# Altium schematic sheet Glog 5G_LTE.SchDoc: RCW-360Pro-4G
size A3; Author: GAOQIANBO; DocumentNumber: JC-2.757.366DL; SheetNumber: 2; SheetTotal: 2
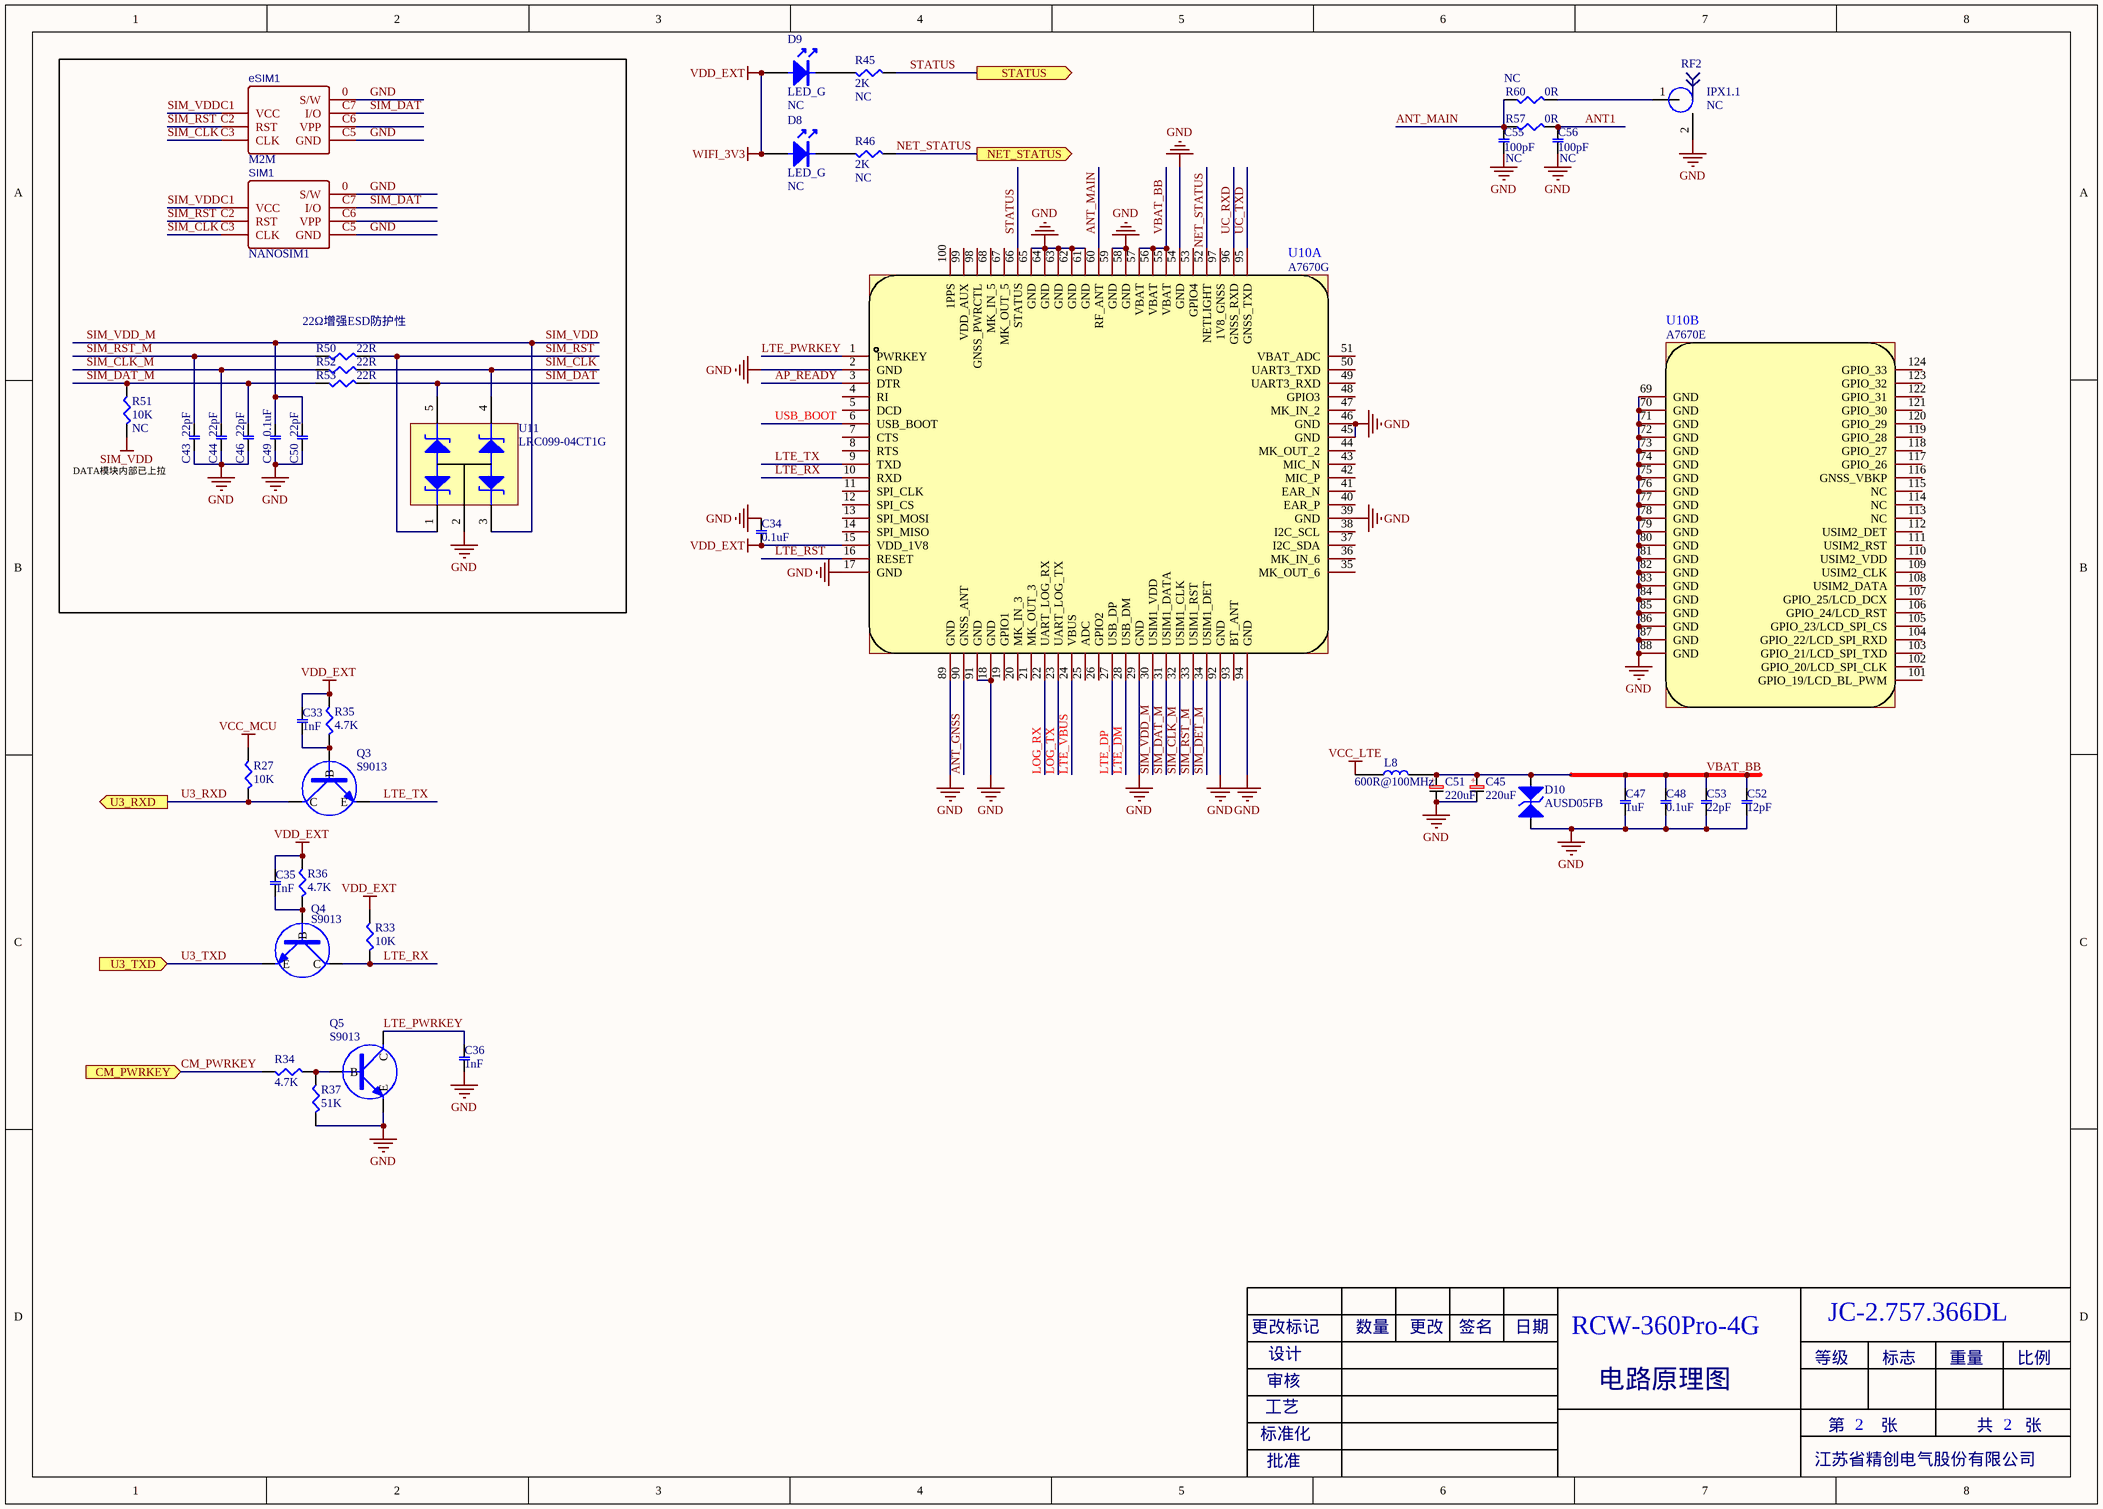
[diagram p0: Glog 5G_LTE.SchDoc]

## Parts
C33  1nF  [0402C]
C34  0.1uF  [0402C]
C35  1nF  [0402C]
C36  1nF  [0402C]
C43  22pF  [0402C]
C44  22pF  [0402C]
C45  220uF  [3528C]
C46  22pF  [0402C]
C47  1uF  [0402C]
C48  0.1uF  [0402C]
C49  0.1uF  [0402C]
C50  22pF  [0402C]
C51  220uF  [3528C]
C52  12pF  [0402C]
C53  22pF  [0402C]
C55  选焊: NC  [0402C]  (hidden comment: 100pF)
C56  选焊: NC  [0402C]  (hidden comment: 100pF)
D8  选焊: NC  [LED-0603]  (hidden comment: LED_G)
D9  选焊: NC  [LED-0603]  (hidden comment: LED_G)
D10  AUSD05FB  [BV05C]
eSIM1  M2M  [QFN5*6-8]
L8  600R@100MHz  [0603L]
Q3  S9013  [SOT23-N]
Q4  S9013  [SOT23-N]
Q5  S9013  [SOT23-N]
R27  10K  [0402R]
R33  10K  [0402R]
R34  4.7K  [0402R]
R35  4.7K  [0402R]
R36  4.7K  [0402R]
R37  51K  [0402R]
R45  选焊: NC  [0402R]  (hidden comment: 2K)
R46  选焊: NC  [0402R]  (hidden comment: 2K)
R50  22R  [0402R]
R51  选焊: NC  [0402R]  (hidden comment: 10K)
R52  22R  [0402R]
R53  22R  [0402R]
R57  0R  [0402R]
R60  选焊: NC  [0402R]  (hidden comment: 0R)
RF2  选焊: NC  [IPEX_3PIN]  (hidden comment: IPX1.1)
SIM1  NANOSIM1  [NANO_SIM SMT 翻盖式]
U10  A7670G  [A7670xx]  (parts A,B of 2)
U11  LRC099-04CT1G  [SOT-353]

## Blocks framed on the sheet
22Ω增强ESD防护性: C43 C44 C46 C49 C50 eSIM1 R50-R53 SIM1 U11

## Ports
CM_PWRKEY (in), NET_STATUS (out), STATUS (out), U3_RXD (out), U3_TXD (in)

## Nets
GND: C34.2 C36.1 C43.1 C44.1 C45.2 C46.1 C47.2 C48.2 C49.2 C50.1 C51.2 C52.1 C53.1 C55.2 C56.2 D10.2(K) eSIM1.0(S/W) eSIM1.C5(GND) Q5.E R37.2 RF2.2 SIM1.0(S/W) SIM1.C5(GND) U10.2(GND) U10.17(GND) U10.18(GND) U10.29(GND) U10.39(GND) U10.45(GND) U10.46(GND) U10.54(GND) U10.58(GND) U10.59(GND) U10.61(GND) U10.62(GND) U10.63(GND) U10.64(GND) U10.65(GND) U10.69(GND) U10.70(GND) U10.71(GND) U10.72(GND) U10.73(GND) U10.74(GND) U10.75(GND) U10.76(GND) U10.77(GND) U10.78(GND) U10.79(GND) U10.80(GND) U10.81(GND) U10.82(GND) U10.83(GND) U10.84(GND) U10.85(GND) U10.86(GND) U10.87(GND) U10.88(GND) U10.89(GND) U10.91(GND) U10.92(GND) U10.94(GND) U11.2
SIM_VDD: C49.1 C50.2 eSIM1.C1(VCC) R51.1 SIM1.C1(VCC) U10.30(USIM1_VDD) U11.3  [also labelled SIM_VDD_M]
VCC_LTE: L8.1
VCC_MCU: R27.1
VDD_EXT: C33.2 C34.1 C35.2 D8.1(A) D9.1(A) R33.1 R35.2 R36.2 U10.15(VDD_1V8)  [also labelled WIFI_3V3]
ANT1: C56.1 R57.2
ANT_GNSS: U10.90(GNSS_ANT)
ANT_MAIN: C55.1 R57.1 R60.1 U10.60(RF_ANT)
AP_READY: U10.3(DTR)
CM_PWRKEY: R34.2 ; port CM_PWRKEY
LOG_RX: U10.22(UART_LOG_RX)
LOG_TX: U10.23(UART_LOG_TX)
LTE_DM: U10.28(USB_DM)
LTE_DP: U10.27(USB_DP)
LTE_PWRKEY: C36.2 Q5.C U10.1(PWRKEY)
LTE_RST: U10.16(RESET)
LTE_RX: Q4.C R33.2 U10.10(RXD)
LTE_TX: Q3.E U10.9(TXD)
LTE_VBUS: U10.24(VBUS)
NET_STATUS: R46.1 U10.52(NETLIGHT) ; port NET_STATUS
SIM_CLK: eSIM1.C3(CLK) R52.2 SIM1.C3(CLK) U11.4
SIM_CLK_M: C44.2 R52.1 U10.32(USIM1_CLK)
SIM_DAT: eSIM1.C7(I/O) R53.2 SIM1.C7(I/O) U11.5
SIM_DAT_M: C46.2 R51.2 R53.1 U10.31(USIM1_DATA)
SIM_DET_M: U10.34(USIM1_DET)
SIM_RST: eSIM1.C2(RST) R50.2 SIM1.C2(RST) U11.1
SIM_RST_M: C43.2 R50.1 U10.33(USIM1_RST)
STATUS: R45.1 U10.66(STATUS) ; port STATUS
U3_RXD: Q3.C R27.2 ; port U3_RXD
U3_TXD: Q4.E ; port U3_TXD
UC_RXD: U10.96(GNSS_RXD)
UC_TXD: U10.95(GNSS_TXD)
USB_BOOT: U10.6(USB_BOOT)
VBAT_BB: C45.1 C47.1 C48.1 C51.1 C52.2 C53.2 D10.1(A) L8.2 U10.55(VBAT) U10.56(VBAT) U10.57(VBAT)
NetC33_1: C33.1 Q3.B R35.1
NetC35_1: C35.1 Q4.B R36.1
NetD8_2: D8.2(K) R46.2
NetD9_2: D9.2(K) R45.2
NetQ5_B: Q5.B R34.1 R37.1
NetR60_2: R60.2 RF2.1

Not connected (* = marked no-connect by the designer): eSIM1 C6(VPP); SIM1 C6(VPP); U10 4(RI) 5(DCD) 7(CTS) 8(RTS) 11(SPI_CLK) 12(SPI_CS) 13(SPI_MOSI) 14(SPI_MISO) 19(GPIO1) 20(MK_IN_3) 21(MK_OUT_3) 25(ADC) 26(GPIO2) 35(MK_OUT_6) 36(MK_IN_6) 37(I2C_SDA) 38(I2C_SCL) 40(EAR_P) 41(EAR_N) 42(MIC_P) 43(MIC_N) 44(MK_OUT_2) 47(MK_IN_2) 48(GPIO3) 49(UART3_RXD) 50(UART3_TXD) 51(VBAT_ADC) 53(GPIO4) 67(MK_OUT_5) 68(MK_IN_5) 93(BT_ANT) 97(1V8_GNSS) 98(GNSS_PWRCTL) 99(VDD_AUX) 100(1PPS) 101(GPIO_19/LCD_BL_PWM) 102(GPIO_20/LCD_SPI_CLK) 103(GPIO_21/LCD_SPI_TXD) 104(GPIO_22/LCD_SPI_RXD) 105(GPIO_23/LCD_SPI_CS) 106(GPIO_24/LCD_RST) 107(GPIO_25/LCD_DCX) 108(USIM2_DATA) 109(USIM2_CLK) 110(USIM2_VDD) 111(USIM2_RST) 112(USIM2_DET) 113(NC) 114(NC) 115(NC) 116(GNSS_VBKP) 117(GPIO_26) 118(GPIO_27) 119(GPIO_28) 120(GPIO_29) 121(GPIO_30) 122(GPIO_31) 123(GPIO_32) 124(GPIO_33)

## Notes on the sheet
- (near R51) DATA模块内部已上拉
- 更改标记
- 审核
- 设计
- 数量
- 更改
- 签名
- 日期
- 电路原理图
- 等级
- 标志
- 重量
- 比例
- 标准化
- 工艺
- 第        张
- 共       张
- 批准
- 江苏省精创电气股份有限公司
- (in symbol 220μF/6.3V/CASE-B_3528±20﹪) +

## Library data of the parts
C33 C35 C36 = CC-0402-X7R-50V-102±10%,风华高科,RoHS: 物料编码(*): 30102010010; 物料名称: 贴片瓷片电容; 参考价格: 0.038; 用量分母: 1; 贴片/插件: SMD; Values: 1nF; 规格型号: CC-0402-X7R-50V-102±10%,风华高科,RoHS
C34 C48 C49 = CC-0402-50V-104±20%: 物料编码(*): 30102010006; 物料名称: 贴片瓷片电容; 用量分母: 1; 贴片/插件: SMD; Values: 0.1uF; 规格型号: CC-0402-50V-104±20%
C43 C44 C46 C50 C53 = CC-0402-50V-104±20%: 规格型号: CC-0402-50V-NPO-22pF±5%; 物料编码(*): 30102010009; 物料名称: 贴片瓷片电容; 用量分母: 1; 贴片/插件: SMD; Values: 22pF
C45 C51 = 220μF/6.3V/CASE-B_3528±20﹪: 物料编码(*): 30102060016; 物料名称: 贴片钽电容; 用量分母: 1; 贴片/插件: SMD; Values: 220uF; 规格型号: 220μF/6.3V/CASE-B_3528±20﹪
C47 = CC-0402-16V-105±10%: 物料编码(*): 30102010001; 物料名称: 贴片瓷片电容; 用量分母: 1; 贴片/插件: SMD; Values: 1uF; 规格型号: CC-0402-16V-105±10%
C52 = CC-0402-50V-NPO-12pF±5%: 物料编码(*): 30102010007; 物料名称: 贴片瓷片电容; 用量分母: 1; 贴片/插件: SMD; Values: 12pF; 规格型号: CC-0402-50V-NPO-12pF±5%
C55 C56 = CC-0402-50V-101±5﹪: 物料编码(*): 30102010008; 物料名称: 贴片瓷片电容; 用量分母: 1; 贴片/插件: SMD; Values: 100pF; 规格型号: CC-0402-50V-101±5﹪
D8 D9 = 0603,绿色: 物料编码(*): 30107010011; 物料名称: 贴片发光二极管; 参考价格: 0.116; 用量分母: 1; 贴片/插件: SMD; Values: LED_G; 规格型号: 0603,绿色
D10 = AUSD05FB,SOD-323,ESD: 物料编码(*): 30104010062; 物料名称: 贴片二极管; 用量分母: 1; 贴片/插件: SMD; Values: AUSD05FB; 规格型号: AUSD05FB,SOD-323,ESD
eSIM1 = NANOSIM1.4H6P掀盖式: 规格型号: eSIM-QFN5*6-8; 物料编码(*): 301170601xx; 物料名称: SIM卡座; 参考价格: 0.95; 用量分母: 1; 贴片/插件: SMD; Values: M2M
L8 = CGB160808U601T/600R@100MHz,0603: 物料编码(*): 30103110002; 物料名称: 贴片磁珠; 用量分母: 1; 贴片/插件: SMD; Values: 600R@100MHz; 规格型号: CGB160808U601T/600R@100MHz,0603
Q3-Q5 = S9013,SOT-23: 物料编码(*): 30104020002; 物料名称: 贴片三极管; 用量分母: 1; 贴片/插件: SMD; Values: S9013; 规格型号: S9013,SOT-23; Footprint: SOT23-P
R27 R33 R51 = RC-0402-1/16W-10K±5%: 物料编码(*): 30101010012; 物料名称: 贴片电阻; 用量分母: 1; 贴片/插件: SMD; 规格型号: RC-0402-1/16W-10K±5%; Values: 10K
R34-R36 = RC-0402-1/16W-4.7K±1%: 物料编码(*): 30101010005; 物料名称: 贴片电阻; 用量分母: 1; 贴片/插件: SMD; 规格型号: RC-0402-1/16W-4.7K±1%; Values: 4.7K
R37 = RC-0402-1/16W-51K±1%: 物料编码(*): 30101010014; 物料名称: 贴片电阻; 参考价格: 0.0015; 用量分母: 1; 贴片/插件: SMD; Values: 51K; 规格型号: RC-0402-1/16W-51K±1%
R45 R46 = RC-0402-1/16W-2K±5%: 物料编码(*): 30101010011; 物料名称: 贴片电阻; 参考价格: 0.0015; 用量分母: 1; 贴片/插件: SMD; Values: 2K; 规格型号: RC-0402-1/16W-2K±5%
R50 R52 R53 = RC-0402-1/16W-22±1%: 物料编码(*): 30101010009; 物料名称: 贴片电阻; 参考价格: 0.0015; 用量分母: 1; 贴片/插件: SMD; Values: 22R; 规格型号: RC-0402-1/16W-22±1%
R57 R60 = RC-0402-1/16W-0±1%: 物料编码(*): 30101010001; 物料名称: 贴片电阻; 用量分母: 1; 贴片/插件: SMD; 规格型号: RC-0402-1/16W-0±1%; Values: 0R
RF2 = IPX座子,UFL-R-SMT_01: 物料编码(*): 30117060014; 物料名称: 插头/插座; 参考价格: 0.6; 用量分母: 1; 贴片/插件: SMD; Values: IPX1.1; 规格型号: IPX座子,UFL-R-SMT_01
SIM1 = NANOSIM1.4H6P掀盖式: 物料编码(*): 30117060181; 物料名称: SIM卡座; 参考价格: 0.95; 用量分母: 1; 贴片/插件: SMD; Values: NANOSIM1; 规格型号: NANOSIM1.4H6P掀盖式
U10 = A7670E,LTE-Cat1,GSM,欧版,LGA: 物料编码(*): 301060100xx; 物料名称: 4G模块; 参考价格: 40; 用量分母: 1; 贴片/插件: SMD; Values: A7670G; 规格型号: A7670E,LTE-Cat1,GSM,欧版,LGA
U11 = LESDA6V8AW5T1G: 物料编码(*): 30104090002; 物料名称: 其他贴片晶体管(阵列); 用量分母: 1; 贴片/插件: SMD; Values: LRC099-04CT1G; 规格型号: LRC099-04CT1G